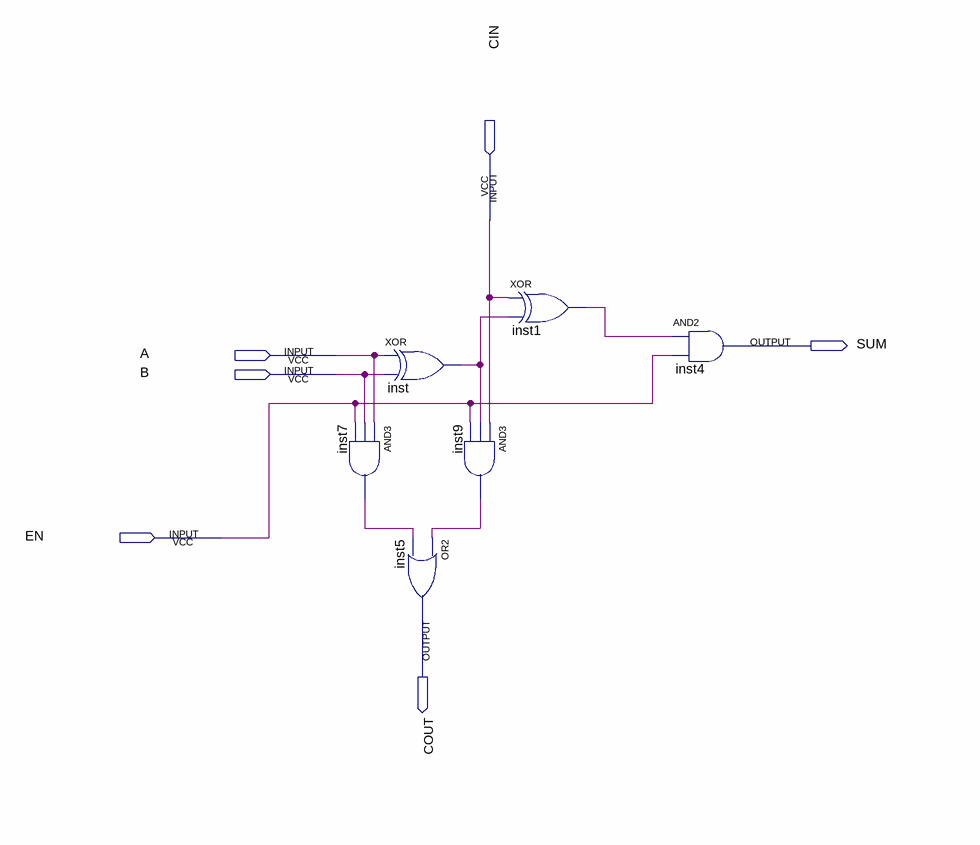
[diagram p0: schematic sheet]
// Quartus schematic FULL_ADDER_1bit.bdf as structural Verilog: 6 symbols, 6 pins
module FULL_ADDER_1bit (
  input  CIN,
  input  A,
  input  B,
  input  EN,
  output SUM,
  output COUT
);

  wire inst1_out, inst7_out, inst9_out, inst_out;

  and inst7 (inst7_out, A, B, EN);
  xor inst (inst_out, A, B);
  and inst9 (inst9_out, CIN, inst_out, EN);
  or inst5 (COUT, inst9_out, inst7_out);
  xor inst1 (inst1_out, CIN, inst_out);
  and inst4 (SUM, inst1_out, EN);
endmodule
